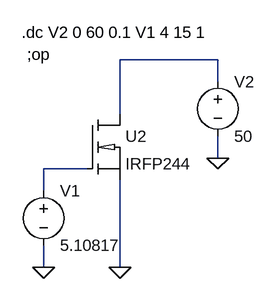
[diagram p0: schematic IRFP244_test.asc]
IRFP244_test.asc, the LTspice schematic file:
Version 4
SHEET 1 880 680
WIRE 256 128 112 128
WIRE 256 160 256 128
WIRE 112 208 112 128
WIRE 256 272 256 240
WIRE 64 288 0 288
WIRE 0 320 0 288
WIRE 0 432 0 400
WIRE 112 432 112 304
FLAG 0 432 0
FLAG 112 432 0
FLAG 256 272 0
SYMBOL voltage 0 304 R0
WINDOW 123 0 0 Left 0
WINDOW 39 0 0 Left 0
SYMATTR InstName V1
SYMATTR Value 5.10817
SYMBOL voltage 256 144 R0
WINDOW 123 0 0 Left 0
WINDOW 39 0 0 Left 0
SYMATTR InstName V2
SYMATTR Value 50
SYMBOL IRFP244 64 208 R0
SYMATTR InstName U2
TEXT -32 88 Left 0 !.dc V2 0 60 0.1 V1 4 15 1
TEXT -24 120 Left 0 !;op

The netlist it stands for:
* IRFP244_test.asc
V1 N002 0 5.10817
V2 N001 0 50
XU2 N002 N001 0 IRFP244  ; pins G D S
.dc V2 0 60 0.1 V1 4 15 1
;op
.lib IRFP244_ekv.sub
.backanno
.end